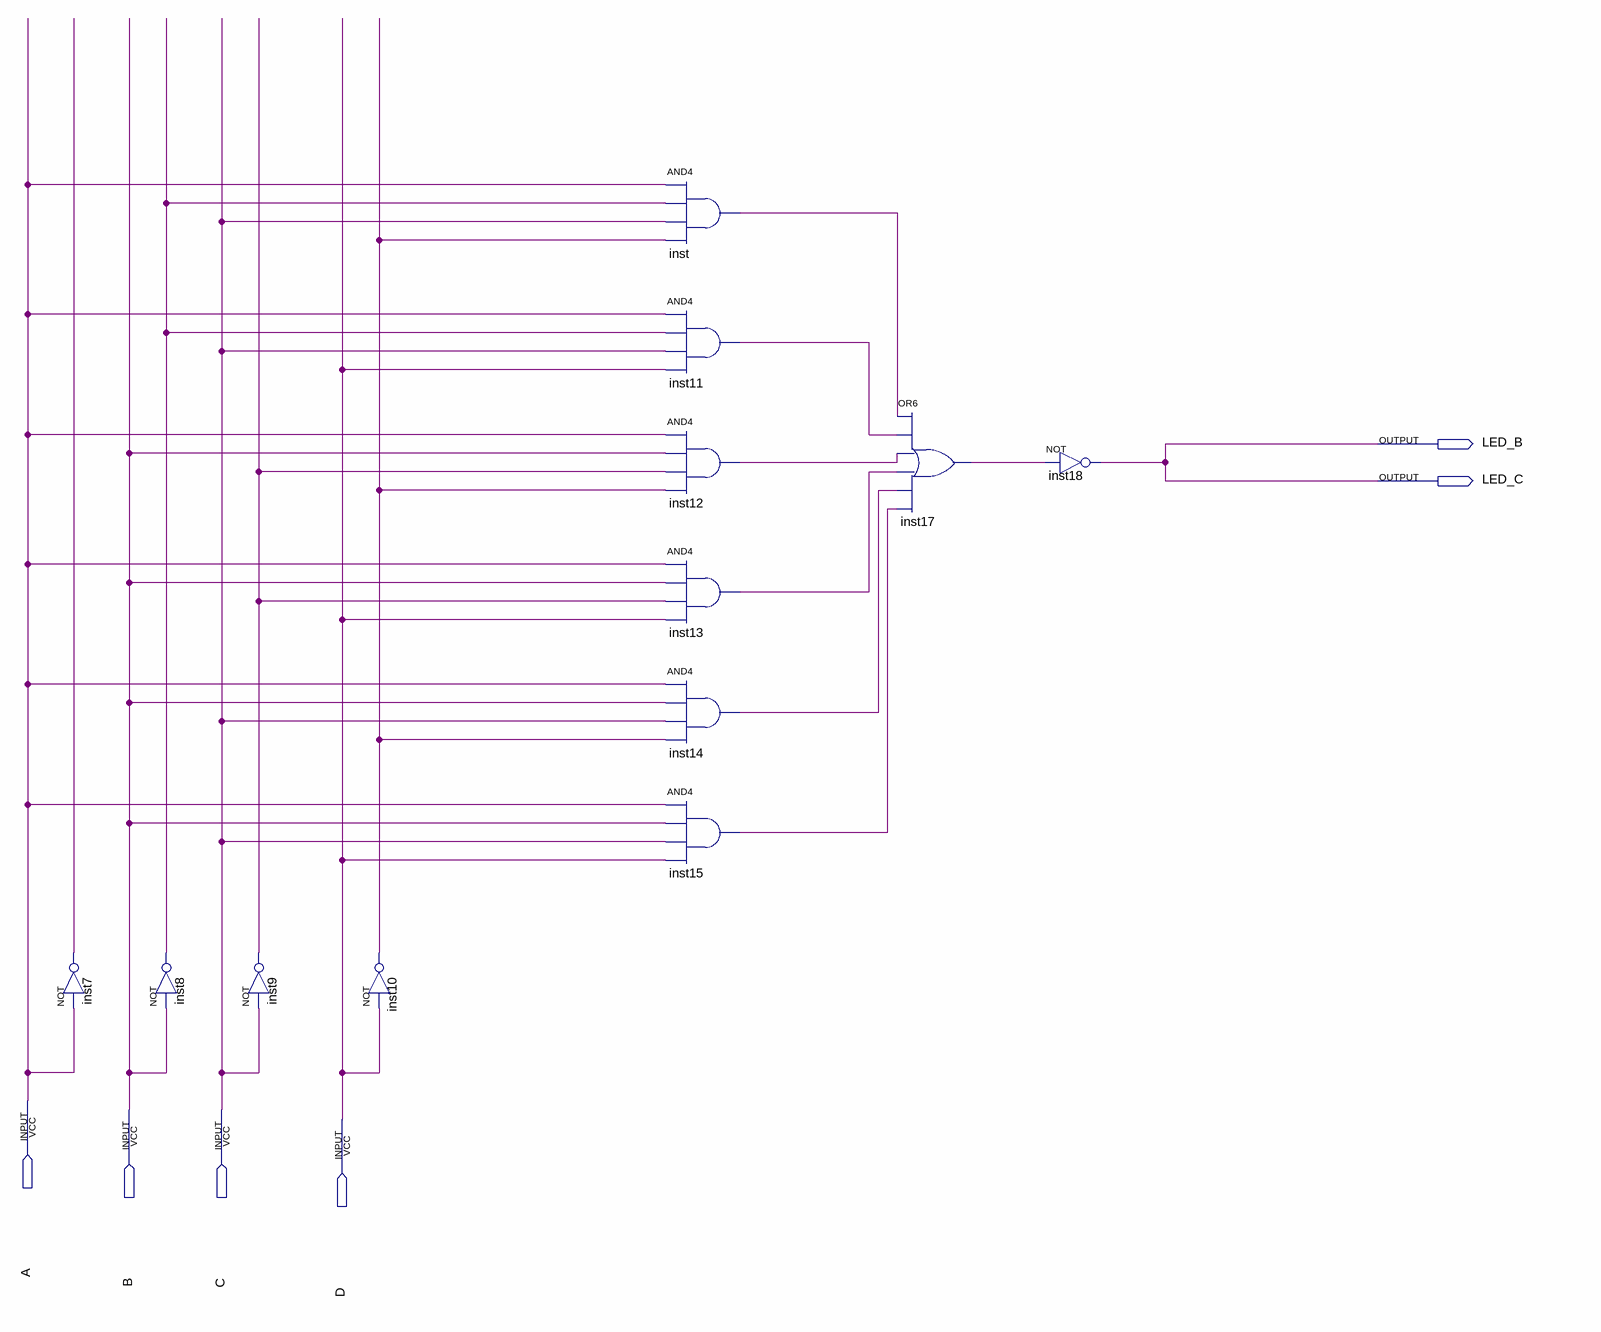
[diagram p0: schematic sheet]
// Quartus schematic 7_seg_A_esquerdo.bdf as structural Verilog: 12 symbols, 6 pins
module \7_seg_A_esquerdo  (
  input  A,
  input  B,
  input  C,
  input  D,
  output LED_B,
  output LED_C
);

  wire inst7_out, inst8_out, inst9_out, inst10_out, inst11_out, inst12_out, inst13_out, inst14_out,
       inst15_out, inst17_out, inst_out;

  not inst7 (inst7_out, A);
  not inst8 (inst8_out, B);
  not inst9 (inst9_out, C);
  not inst10 (inst10_out, D);
  and inst (inst_out, A, inst8_out, C, inst10_out);
  and inst11 (inst11_out, A, inst8_out, C, D);
  and inst12 (inst12_out, A, B, inst9_out, inst10_out);
  and inst13 (inst13_out, A, B, inst9_out, D);
  and inst14 (inst14_out, A, B, C, inst10_out);
  and inst15 (inst15_out, A, B, C, D);
  or inst17 (inst17_out, inst_out, inst11_out, inst12_out, inst13_out, inst14_out, inst15_out);
  not inst18 (LED_B, inst17_out);

  assign LED_C = LED_B;
endmodule
